# EAGLE design TCC_COMPLETO-10 (EAGLE 4.16)
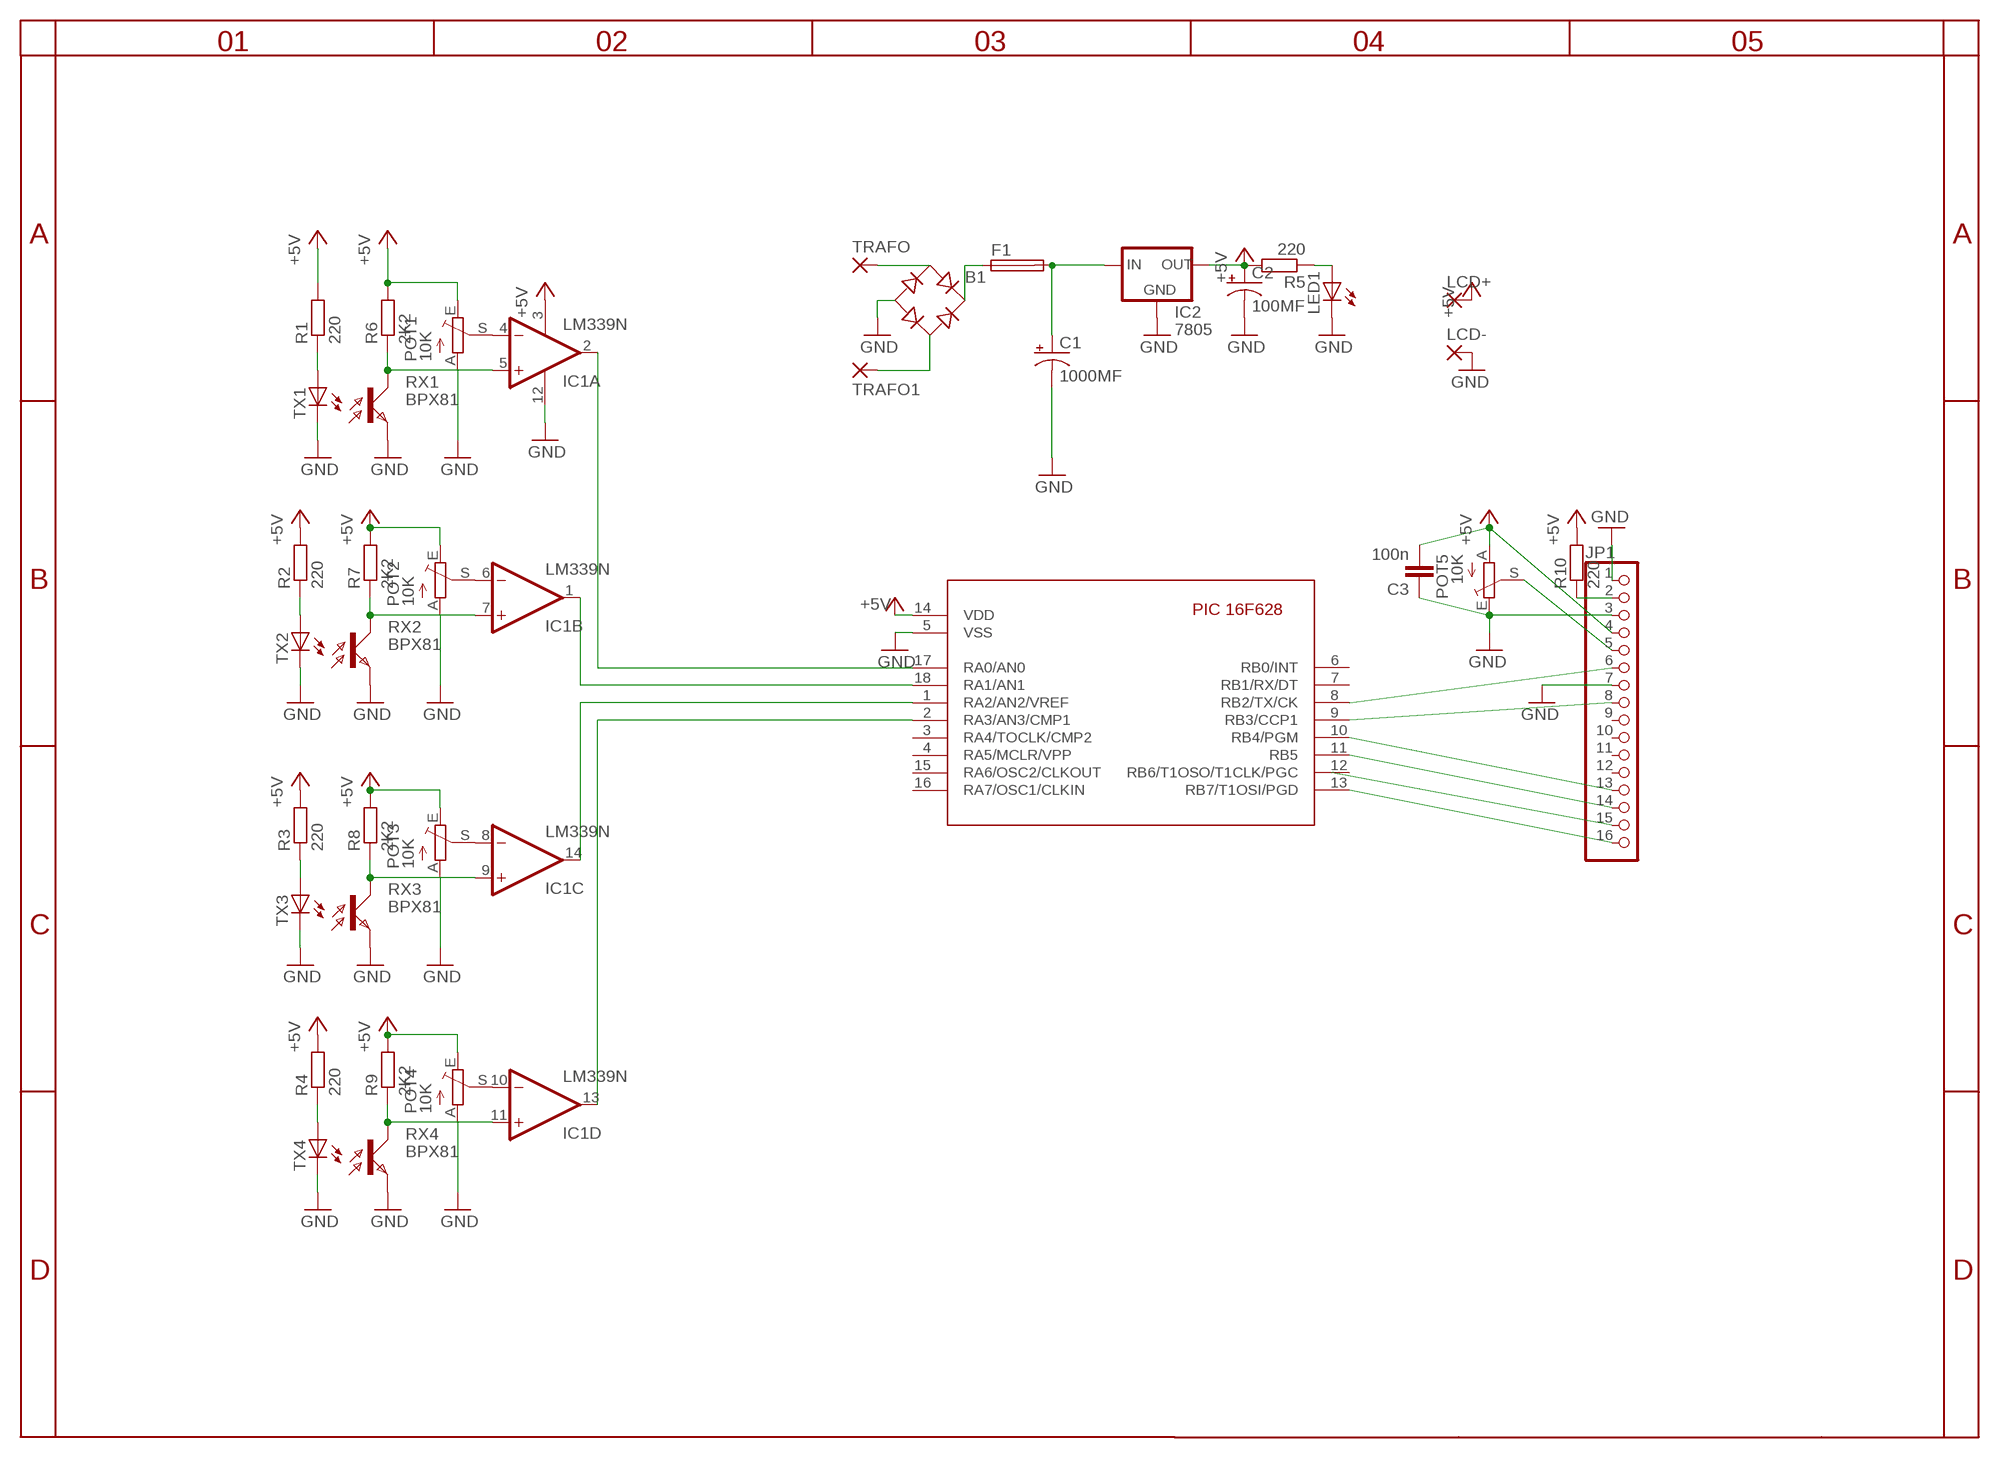
[diagram p0: schematic, sheet 1]

## Parts
B1  RB1A  [RB1A]
C1  1000MF  CPOL-USE5-10.5  [E5-10,5]
C2  100MF  CPOL-USE5-8.5  [E5-8,5]
C3  100n  CYYC7B5  [YC7B5]
F1  SH22,5  [SH22,5]
IC1  LM339N  [DIL14]
IC2  7805  78XXS  [78XXS]
JP1  PINHD-1X16  [1X16]
LCD+  2,54/1,0  [2,54/1,0]
LCD-  2,54/1,0  [2,54/1,0]
LED1  LED5MM  [LED5MM]
POT1  10K  TRIM_EU-LI10  [LI10]
POT2  10K  TRIM_EU-LI10  [LI10]
POT3  10K  TRIM_EU-LI10  [LI10]
POT4  10K  TRIM_EU-LI10  [LI10]
POT5  10K  TRIM_EU-LI10  [LI10]
R1  220  R-EU_0207/10  [0207/10]
R2  220  R-EU_0207/10  [0207/10]
R3  220  R-EU_0207/10  [0207/10]
R4  220  R-EU_0207/10  [0207/10]
R5  220  R-EU_0207/10  [0207/10]
R6  2K2  R-EU_0207/10  [0207/10]
R7  2K2  R-EU_0207/10  [0207/10]
R8  2K2  R-EU_0207/10  [0207/10]
R9  2K2  R-EU_0207/10  [0207/10]
R10  220  R-EU_0207/10  [0207/10]
RX1  BPX81  [BPX81]
RX2  BPX81  [BPX81]
RX3  BPX81  [BPX81]
RX4  BPX81  [BPX81]
TRAFO  2,54/1,0  [2,54/1,0]
TRAFO1  2,54/1,0  [2,54/1,0]
TX1  LED5MM  [LED5MM]
TX2  LED5MM  [LED5MM]
TX3  LED5MM  [LED5MM]
TX4  LED5MM  [LED5MM]
U$1  16F628  [PIC16F628-18-LEAD-PDIP]

## Nets
+5V: C2.+ C3.2 IC1.3(P:V+) IC2.OUT JP1.4 LCD+.1(P) POT1.E POT2.E POT3.E POT4.E POT5.A R1.2 R2.2 R3.2 R4.2 R5.2 R6.2 R7.2 R8.2 R9.2 R10.2 U$1.14(VDD)
GND: B1.- C1.- C2.- C3.1 IC1.12(P:GND) IC2.GND JP1.1 JP1.3 JP1.7 LCD-.1(P) LED1.K(C) POT1.A POT2.A POT3.A POT4.A POT5.E RX1.E RX2.E RX3.E RX4.E TX1.K(C) TX2.K(C) TX3.K(C) TX4.K(C) U$1.5(VSS)
N$1: JP1.6 U$1.8(RB2/TX/CK)
N$2: JP1.8 U$1.9(RB3/CCP1)
N$3: JP1.16 U$1.13(RB7/T1OSI/PGD)
N$4: JP1.15
N$5: JP1.14 U$1.11(RB5)
N$6: JP1.13 U$1.10(RB4/PGM)
N$8: LED1.A R5.1
N$9: JP1.2 R10.1
N$10: JP1.5 POT5.S
N$11: IC1.9(C:+IN) R8.1 RX3.C
N$12: IC1.4(A:-IN) POT1.S
N$13: IC1.6(B:-IN) POT2.S
N$14: IC1.8(C:-IN) POT3.S
N$15: IC1.10(D:-IN) POT4.S
N$18: R1.1 TX1.A
N$19: R2.1 TX2.A
N$20: R3.1 TX3.A
N$21: R4.1 TX4.A
N$22: IC1.5(A:+IN) R6.1 RX1.C
N$24: IC1.11(D:+IN) R9.1 RX4.C
N$26: IC1.2(A:OUT) U$1.17(RA0/AN0)
N$27: B1.AC1 TRAFO.1(P)
N$28: C1.+ F1.2 IC2.IN
N$29: B1.AC2 TRAFO1.1(P)
N$30: B1.+ F1.1
N$31: IC1.1(B:OUT) U$1.18(RA1/AN1)
N$32: IC1.14(C:OUT) U$1.1(RA2/AN2/VREF)
N$33: IC1.13(D:OUT) U$1.2(RA3/AN3/CMP1)
N$34: IC1.7(B:+IN) R7.1 RX2.C
Unconnected: JP1.9 JP1.10 JP1.11 JP1.12 U$1.3(RA4/TOCLK/CMP2) U$1.4(RA5/MCLR/VPP) U$1.6(RB0/INT) U$1.7(RB1/RX/DT) U$1.12(RB6/T1OSO/T1CLK/PGC) U$1.15(RA6/OSC2/CLKOUT) U$1.16(RA7/OSC1/CLKIN)

## Library data of the parts
B1 = rectifier:RB1A: RECTIFIER 1 A
C1 C2 = rcl:CPOL-US: POLARIZED CAPACITOR, American symbol
C3 = rcl:CY: Y CAPACITOR for power line
F1 = fuse:SH22,5: FUSE HOLDER grid 22,5 mm, OGN0031 8201, Schurter (Buerklin)
IC1 = linear:LM339: Low Power Low Offset Voltage Quad Comparators with open collector; LM139/LM239/LM339/LM2901/LM3302
IC2 = v-reg:78XXS: VOLTAGE REGULATOR
JP1 = pinhead:PINHD-1X16: PIN HEADER
LCD+ LCD- TRAFO TRAFO1 = wirepad:2,54/1,0: THROUGH-HOLE PAD
LED1 TX1-TX4 = led:LED: LED OSRAM: - CHIPLED LG R971, LG N971, LY N971, LG Q971, LY Q971, LO R971, LY R971 LH N974, LH R974 LS Q976, LO Q976, LY Q976 LO Q996 - Hyper CHIPLED LW Q18S LB Q993, LB Q99A, LB R99A - SideLED LS A670, LO A670, LY A670, LG A670, LP A670 LB A673, LV A673, LT A673, LW A673 LH A674 LY A675 LS A676, LA A676, LO A676, LY A676, LW A676 LS A679, LY A679, LG A679 - Hyper Micro SIDELED® LS Y876, LA Y876, LO Y876, LY Y876 LT Y87S - SmartLED LW L88C, LW L88S LB L89C, LB L89S, LG L890 LS L89K, LO L89K, LY L89K LS L896, LA L896, LO L896, LY L896 - TOPLED LS T670, LO T670, LY T670, LG T670, LP T670 LSG T670, LSP T670, LSY T670, LOP T670, LYG T670 LG T671, LOG T671, LSG T671 LB T673, LV T673, LT T673, LW T673 LH T674 LS T676, LA T676, LO T676, LY T676, LB T676, LH T676, LSB T676, LW T676 LB T67C, LV T67C, LT T67C, LS T67K, LO T67K, LY T67K, LW E67C LS E67B, LA E67B, LO E67B, LY E67B, LB E67C, LV E67C, LT E67C LW T67C LS T679, LY T679, LG T679 LS T770, LO T770, LY T770, LG T770, LP T770 LB T773, LV T773, LT T773, LW T773 LH T774 LS E675, LA E675, LY E675, LS T675 LS T776, LA T776, LO T776, LY T776, LB T776 LHGB T686 LT T68C, LB T68C - Hyper Mini TOPLED® LB M676 - Mini TOPLED Santana® LG M470 LS M47K, LO M47K, LY M47K Source: http://www.osram.convergy.de - LUMILED® LXK2-PW12-R00, LXK2-PW12-S00, LXK2-PW14-U00, LXK2-PW14-V00 LXK2-PM12-R00, LXK2-PM12-S00, LXK2-PM14-U00 LXK2-PE12-Q00, LXK2-PE12-R00, LXK2-PE12-S00, LXK2-PE14-T00, LXK2-PE14-U00 LXK2-PB12-K00, LXK2-PB12-L00, LXK2-PB12-M00, LXK2-PB14-N00, LXK2-PB14-P00, LXK2-PB14-Q00 LXK2-PR12-L00, LXK2-PR12-M00, LXK2-PR14-Q00, LXK2-PR14-R00 LXK2-PD12-Q00, LXK2-PD12-R00, LXK2-PD12-S00 LXK2-PH12-R00, LXK2-PH12-S00 LXK2-PL12-P00, LXK2-PL12-Q00, LXK2-PL12-R00 Source: www.luxeon.com
POT1-POT5 = pot:TRIM_EU-: POTENTIOMETER
R1-R10 = rcl:R-EU_: RESISTOR, European symbol
RX1-RX4 = opto-trans-siemens:BPX81: PHOTO TRANSISTOR
U$1 = pic16f6xx-1:16F628: Microchip component PIC 16F628 Eric Magraner - eric_magraner@yahoo.fr 03/2004

## Board
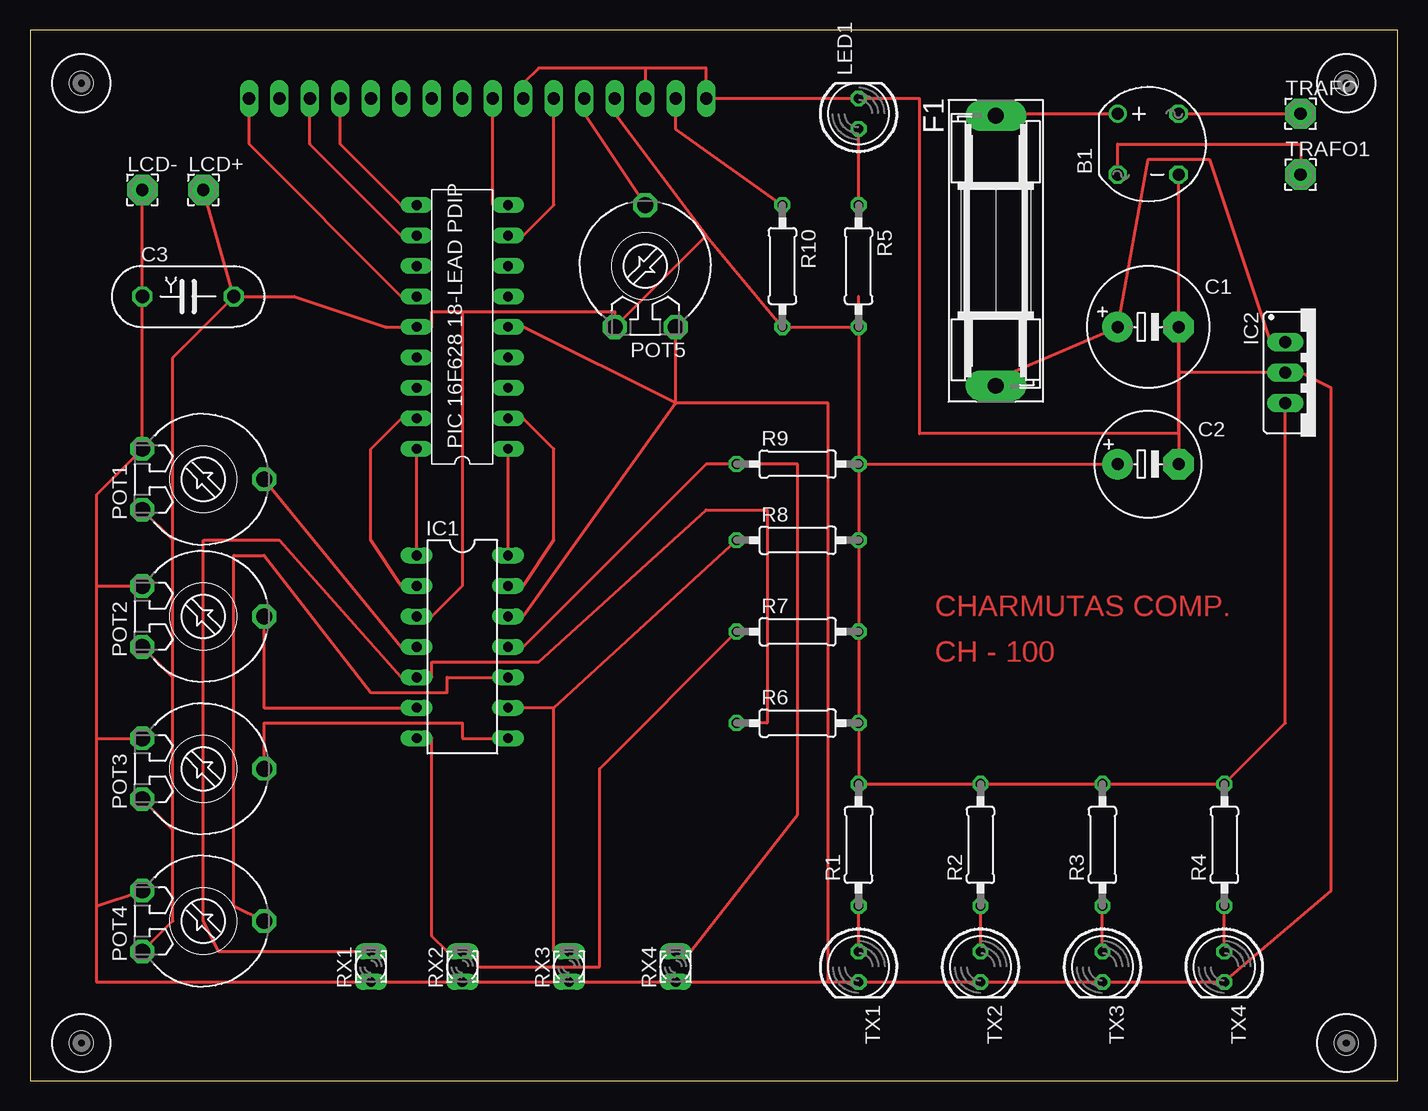
[diagram p1: board, top side]
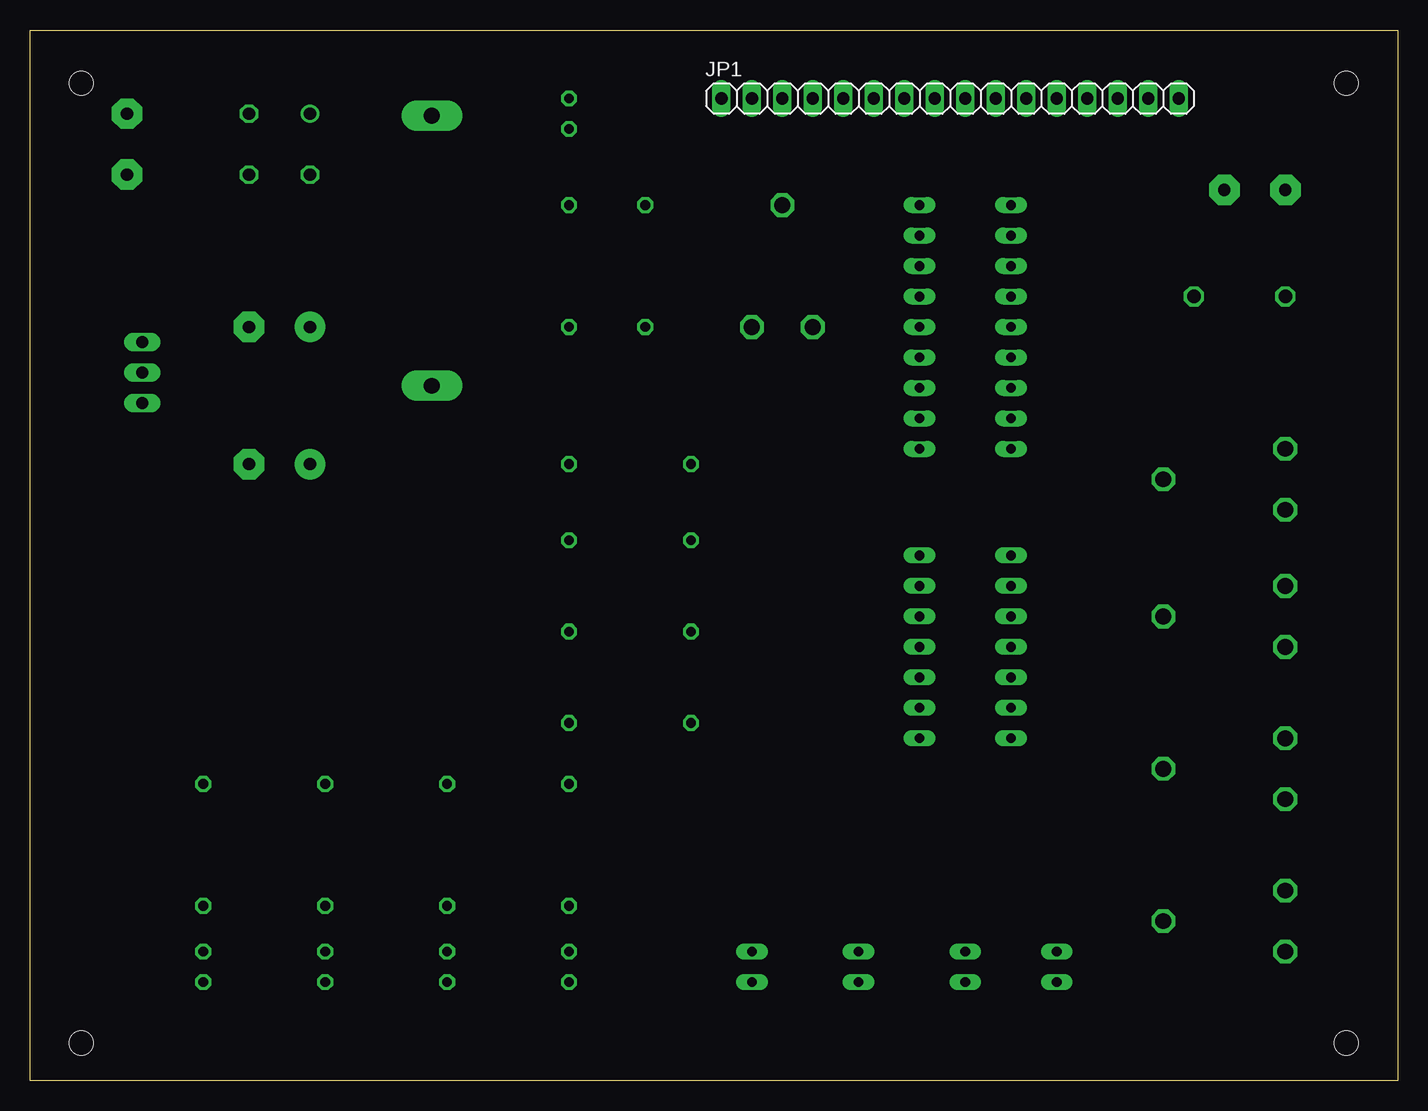
[diagram p2: board, bottom side, seen from below]

Size 113.97 x 87.62 mm. Coordinates in mm from the lower left corner, seen from the top.
Outline: 0,0 113.97,0 113.97,87.62 0,87.62 0,0
Copper layers 1: Top 0.035mm
Design rules "default": minimum track width 10mil, minimum drill 24mil, track to track 8mil, track to pad 8mil, pad to pad 8mil, via to via 8mil, smd to smd 8mil, copper to edge 40mil, drill to drill 8mil, minimum pad ring 10mil, minimum via ring 8mil, stop-mask expansion 4mil, vias tented up to drill 0mil, thermal gap 10mil

### Footprints (pad centres in the part's own frame; a part is rotated, then mirrored left to right if it is on the bottom)
RB1A = drill 1.016 round: + -2.54,2.54 | drill 1.016 octagon: - 2.54,-2.54; AC1 2.54,2.54; AC2 -2.54,-2.54
E5-10,5 = drill 1.016 pad 2.54 round: + -2.54,0 | drill 1.016 pad 2.54 octagon: - 2.54,0
E5-8,5 = drill 1.016 pad 2.54 round: + -2.54,0 | drill 1.016 pad 2.54 octagon: - 2.54,0
YC7B5 = drill 1.118 octagon: 1 -3.81,0; 2 3.81,0
SH22,5 = drill 1.321 pad 2.54 long: 1 -11.252,0; 2 11.252,0
DIL14 = drill 0.813 long: 1 -7.62,-3.81; 2 -5.08,-3.81; 3 -2.54,-3.81; 4 0,-3.81; 5 2.54,-3.81; 6 5.08,-3.81; 7 7.62,-3.81; 8 7.62,3.81; 9 5.08,3.81; 10 2.54,3.81; 11 0,3.81; 12 -2.54,3.81; 13 -5.08,3.81; 14 -7.62,3.81
78XXS = drill 1.016 long: GND 0,-2.54; IN -2.54,-2.54; OUT 2.54,-2.54
1X16 = drill 1.016 long: 1 -19.05,0; 2 -16.51,0; 3 -13.97,0; 4 -11.43,0; 5 -8.89,0; 6 -6.35,0; 7 -3.81,0; 8 -1.27,0; 9 1.27,0; 10 3.81,0; 11 6.35,0; 12 8.89,0; 13 11.43,0; 14 13.97,0; 15 16.51,0; 16 19.05,0
2,54/1,0 = drill 1.016 pad 2.54 octagon: 1 0,0
LED5MM = drill 0.813 octagon: A -1.27,0; K 1.27,0
LI10 = drill 1.321 octagon: A -2.54,-5.08; E 2.54,-5.08; S 0,5.08
0207/10 = drill 0.813 octagon: 1 -5.08,0; 2 5.08,0
BPX81 = drill 0.813 long: C 1.27,0; E -1.27,0
PIC16F628-18-LEAD-PDIP = drill 0.813 long: 1 -10.16,-3.81; 2 -7.62,-3.81; 3 -5.08,-3.81; 4 -2.54,-3.81; 5 0,-3.81; 6 2.54,-3.81; 7 5.08,-3.81; 8 7.62,-3.81; 9 10.16,-3.81; 10 10.16,3.81; 11 7.62,3.81; 12 5.08,3.81; 13 2.54,3.81; 14 0,3.81; 15 -2.54,3.81; 16 -5.08,3.81; 17 -7.62,3.81; 18 -10.16,3.81
DRIL-2 = hole 2: 0,0

### Placement (x,y rotation side)
B1  93.18,78.1 0 top
C1  93.18,62.86 0 top
C2  93.18,51.43 0 top
C3  13.17,65.4 0 top
F1  80.48,69.21 270 top
IC1  36.03,36.19 270 top
IC2  107.15,59.05 270 top
JP1  37.3,81.91 0 bottom
LCD+  14.44,74.29 0 top
LCD-  9.36,74.29 0 top
LED1  69.05,80.64 90 top
POT1  14.44,50.16 270 top
POT2  14.44,38.73 270 top
POT3  14.44,26.03 270 top
POT4  14.44,13.33 270 top
POT5  51.27,67.94 0 top
R1  69.05,19.68 90 top
R2  79.21,19.68 90 top
R3  89.37,19.68 90 top
R4  99.53,19.68 90 top
R5  69.05,67.94 270 top
R6  63.97,29.84 0 top
R7  63.97,37.46 0 top
R8  63.97,45.08 0 top
R9  63.97,51.43 0 top
R10  62.7,67.94 270 top
RX1  28.41,9.52 90 top
RX2  36.03,9.52 90 top
RX3  44.92,9.52 90 top
RX4  53.81,9.52 90 top
TRAFO  105.88,80.64 0 top
TRAFO1  105.88,75.56 0 top
TX1  69.05,9.52 270 top
TX2  79.21,9.52 270 top
TX3  89.37,9.52 270 top
TX4  99.53,9.52 270 top
U$1  36.03,62.86 90 top
U$2  [DRIL-2]  4.28,83.18 0 top
U$3  [DRIL-2]  109.69,3.17 0 top
U$4  [DRIL-2]  109.69,83.18 0 top
U$5  [DRIL-2]  4.28,3.17 0 top

### Tracks (layer width: path | path; a pad name or v marks a point on that pad's centre or on a via)
+5V
  Top 0.254: C3.2 LCD+.1 | R9.2 R8.2 R7.2 R6.2 R1.2 R2.2 R3.2 R4.2 104.61,29.84 IC2.OUT | R5.2 R9.2 | R5.2 69.05,65.4 | R9.2 C2.+ | R5.2 R10.2 56.35,70.48 | 56.35,70.48 48.73,80.64 JP1.4 | 56.35,70.48 POT5.A 48.73,64.13 36.03,64.13 | 36.03,64.13 33.49,64.13 33.49,62.86 U$1.14 29.68,62.86 22.06,65.4 C3.2 | 36.03,64.13 36.03,41.27 33.49,38.73 IC1.3 | POT4.E 11.9,13.33 11.9,20.95 | 11.9,20.95 POT3.E | 11.9,33.65 POT2.E | 11.9,20.95 11.9,33.65 | 11.9,45.08 POT1.E | 11.9,33.65 11.9,45.08 | C3.2 11.9,60.32 11.9,45.08
GND
  Top 0.254: LCD-.1 C3.1 POT1.A 5.55,48.89 5.55,41.27 | 53.81,56.51 41.11,38.73 IC1.12 | 53.81,56.51 41.11,62.86 U$1.5 | 5.55,28.57 5.55,41.27 | 5.55,41.27 POT2.A | 66.51,8.25 TX1.K TX2.K TX3.K TX4.K 108.42,15.87 108.42,57.78 105.88,59.05 IC2.GND 95.72,59.05 | 66.51,8.25 RX4.E RX3.E RX2.E RX1.E 5.55,8.25 5.55,14.6 | 53.81,56.51 66.51,56.51 66.51,8.25 | 95.72,59.05 95.72,53.97 | 95.72,53.97 C2.- | 95.72,53.97 C1.- 95.72,59.05 | 95.72,53.97 B1.- | 53.81,56.51 POT5.E | 51.27,84.45 42.38,84.45 41.11,83.18 JP1.7 | 51.27,84.45 JP1.3 | 51.27,84.45 56.35,84.45 JP1.1 LED1.K 74.13,81.91 74.13,53.97 95.72,53.97 | 5.55,28.57 POT3.A | 5.55,14.6 5.55,28.57 | 5.55,14.6 POT4.A
N$1
  Top 0.254: U$1.8 41.11,70.48 43.65,73.02 JP1.6
N$2
  Top 0.254: U$1.9 38.57,73.02 JP1.8
N$3
  Top 0.254: U$1.13 30.95,65.4 18.25,78.1 JP1.16
N$5
  Top 0.254: U$1.11 30.95,70.48 23.33,78.1 JP1.14
N$6
  Top 0.254: U$1.10 30.95,73.02 25.87,78.1 JP1.13
N$8
  Top 0.254: R5.1 LED1.A
N$9
  Top 0.254: R10.1 53.81,79.37 JP1.2
N$10
  Top 0.254: POT5.S 46.19,80.64 JP1.5
N$11
  Top 0.254: 43.65,31.11 IC1.9 38.57,31.11 | 43.65,31.11 43.65,10.79 RX3.C | 43.65,31.11 R8.1
N$12
  Top 0.254: POT1.S 30.95,36.19 IC1.4
N$13
  Top 0.254: POT2.S 19.52,31.11 IC1.6
N$14
  Top 0.254: IC1.8 36.03,28.57 36.03,29.84 19.52,29.84 POT3.S
N$15
  Top 0.254: POT4.S 16.98,14.6 16.98,43.81 19.52,43.81 28.41,32.38 34.76,32.38 34.76,33.65 IC1.10
N$18
  Top 0.254: TX1.A R1.1
N$19
  Top 0.254: TX2.A R2.1
N$20
  Top 0.254: TX3.A R3.1
N$21
  Top 0.254: TX4.A R4.1
N$22
  Top 0.254: RX1.C 15.71,10.79 14.44,13.33 14.44,45.08 20.79,45.08 30.95,33.65 IC1.5 33.49,33.65 33.49,34.92 42.38,34.92 56.35,47.62 61.43,47.62 61.43,29.84 R6.1
N$24
  Top 0.254: IC1.11 41.11,36.19 56.35,51.43 R9.1 63.97,51.43 63.97,22.22 55.08,10.79 RX4.C
N$26
  Top 0.254: IC1.2 30.95,41.27 28.41,45.08 28.41,52.7 30.95,55.24 U$1.17
N$27
  Top 0.254: B1.AC1 TRAFO.1
N$28
  Top 0.254: IC2.IN 103.34,61.59 98.26,76.83 93.18,76.83 C1.+ 81.75,59.05 F1.2
N$29
  Top 0.254: B1.AC2 90.64,78.1 105.88,78.1 TRAFO1.1
N$30
  Top 0.254: B1.+ 81.75,80.64 F1.1
N$31
  Top 0.254: IC1.1 U$1.18
N$32
  Top 0.254: IC1.14 U$1.1
N$33
  Top 0.254: IC1.13 41.11,41.27 43.65,45.08 43.65,52.7 41.11,55.24 U$1.2
N$34
  Top 0.254: IC1.7 33.49,28.57 33.49,12.06 34.76,10.79 RX2.C 37.3,10.79 37.3,9.52 47.46,9.52 47.46,26.03 R7.1

### Text on the board
Top: CHARMUTAS COMP. | CH - 100